# Altium schematic sheet OSRC.SchDoc
size 379 x 394 mm
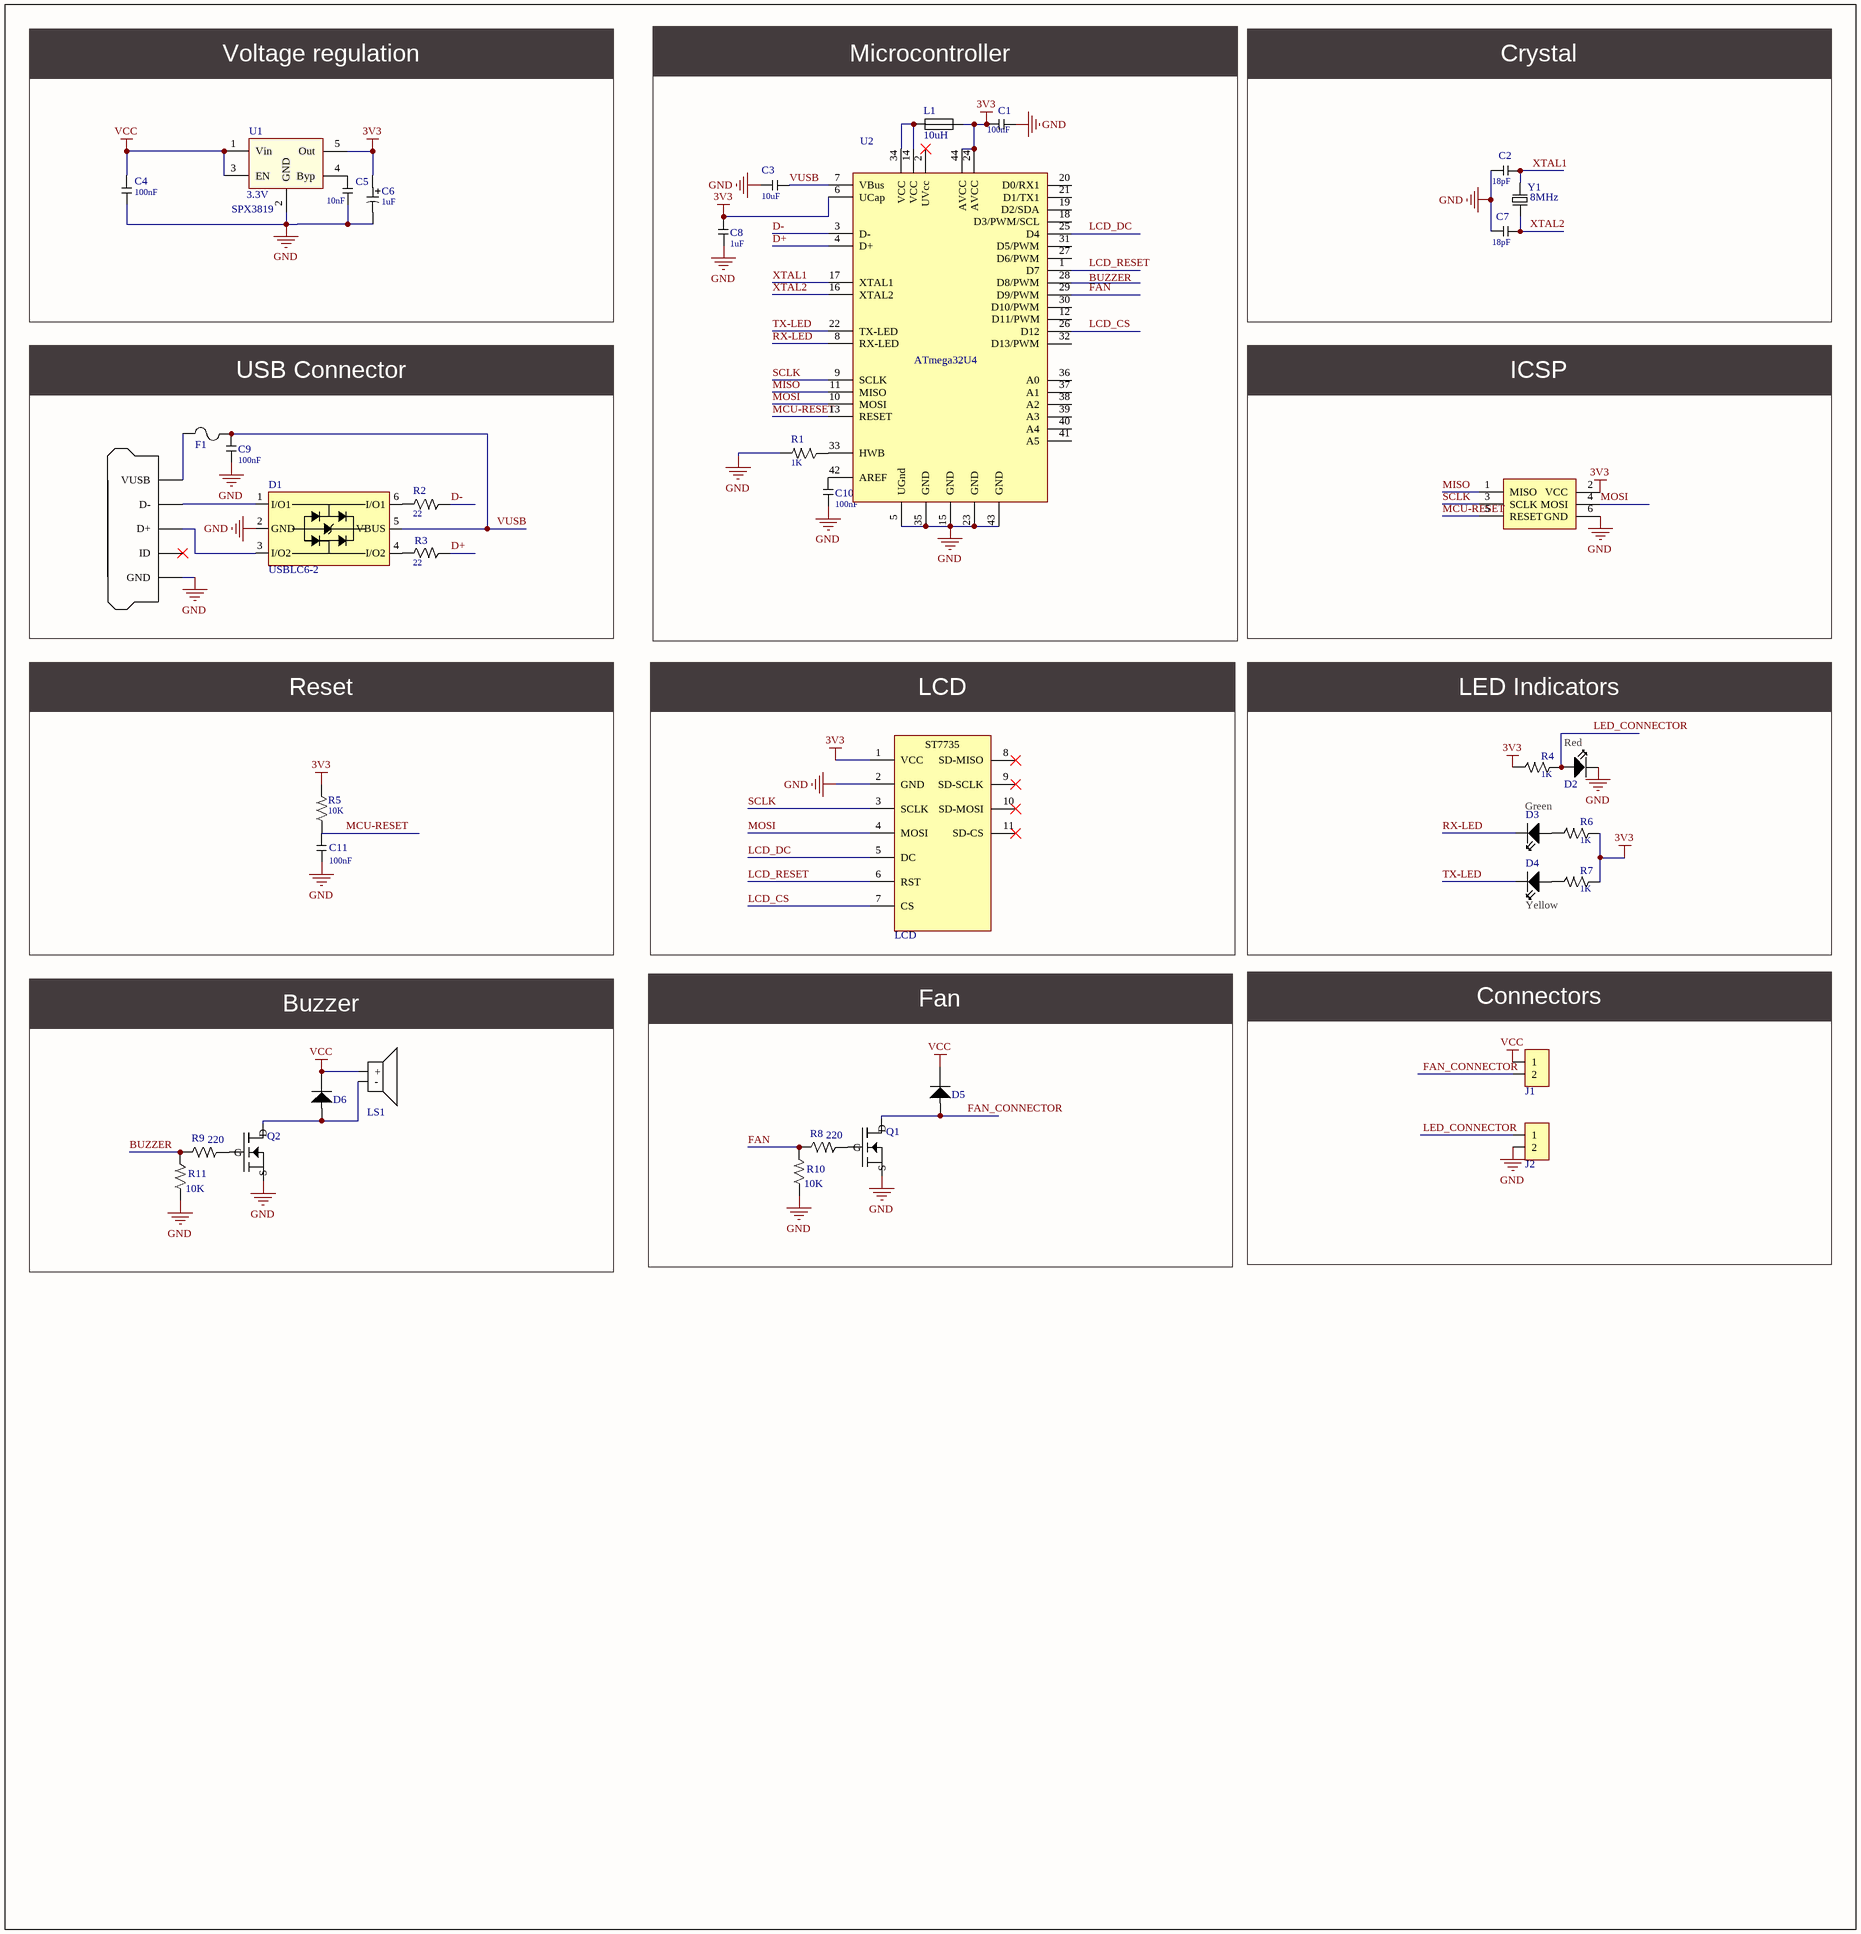
[diagram p0: OSRC.SchDoc]

## Parts
C1  100nF  [CAP-0603-GEN]
C2  18pF  [CAP-0603-GEN]
C3  10uF  [CAP-0603-GEN]
C4  100nF  [CAP-0603-GEN]
C5  10nF  [CAP-0603-GEN]
C6  1uF  [CAP-1206-POL]
C7  18pF  [CAP-0603-GEN]
C8  1uF  [CAP-0603-GEN]
C9  100nF  [CAP-0603-GEN]
C10  100nF  [CAP-0603-GEN]
C11  100nF  [CAP-0603-GEN]
D1  USBLC6-2  [SOT23-6]
D2  Red  [LED 0603 Green]
D3  Green  [LED 0603 Green]
D4  Yellow  [LED 0603 Yellow]
D5  Diode  [DIODE 0603]  (value not drawn)
D6  Diode  [DIODE 0603]  (value not drawn)
F1  Fuse  [FUSE 0603]  (value not drawn)
ICSP1  ICSP  [ICSP-HEADER]  (value not drawn)
J1  Connector 1x2  [PINHEADER 1x2 1.27 Jumper]  (value not drawn)
J2  Connector 1x2  [PINHEADER 1x2 1.27 Jumper]  (value not drawn)
L1  10uH  [FERRITE-0603]
LCD1  LCD  [ST7735]
LS1  Speaker  [Buzzer, Magnetic KTG1212]  (value not drawn)
Q1  (no value)  [SOT23-3]
Q2  (no value)  [SOT23-3]
R1  1K  [RESISTOR 0603]
R2  22  [RESISTOR 0603]
R3  22  [RESISTOR 0603]
R4  1K  [RESISTOR 0603]
R5  10K  [RESISTOR 0603]
R6  1K  [RESISTOR 0603]
R7  1K  [RESISTOR 0603]
R8  220  [RESISTOR 0603]
R9  220  [RESISTOR 0603]
R10  10K  [RESISTOR 0603]
R11  10K  [RESISTOR 0603]
U1  3.3V  [SOT23-5]
U2  ATmega32U4  [TQFP44]
USB1  USB Connector  [USB MICRO-B]  (value not drawn)
Y1  8MHz  [CRYSTAL 5032]

## Blocks framed on the sheet
Voltage regulation: C4-C6 U1
Microcontroller: C1 C3 C8 C10 L1 R1 U2
Crystal: C2 C7 Y1
USB Connector: C9 D1 F1 R2 R3 USB1
ICSP: ICSP1
Reset: C11 R5
LCD: LCD1
LED Indicators: D2-D4 R4 R6 R7
Buzzer: D6 LS1 Q2 R9 R11
Fan: D5 Q1 R8 R10
Connectors: J1 J2

## Nets
3V3: C1.1 C6.1 C8.2 ICSP1.2(VCC) L1.2 LCD1.1(VCC) R4.2 R5.2 R6.1 R7.1 U1.5(Out) U2.6(UCap) U2.24(AVCC) U2.44(AVCC)
GND: C1.2 C2.1 C3.1 C4.1 C5.1 C6.2 C7.1 C8.1 C9.1 C10.2 C11.1 D1.2(GND) D2.2(Cathode) ICSP1.6(GND) J2.2 LCD1.2(GND) Q1.2(S) Q2.2(S) R1.2 R10.1 R11.1 U1.2(GND) U2.5(UGnd) U2.15(GND) U2.23(GND) U2.35(GND) U2.43(GND) USB1.5(GND)
VCC: C4.2 D5.2(Cathode) D6.2(Cathode) J1.1 LS1.1(+) U1.1(Vin) U1.3(EN)
BUZZER: R9.1 R11.2
D+: R3.2 U2.4(D+)
D-: R2.2 U2.3(D-)
FAN: R8.1 R10.2 U2.29(D9/PWM)
FAN_CONNECTOR: D5.1(Anode) J1.2 Q1.3(D)
LCD_CS: LCD1.7(CS) U2.26(D12)
LCD_DC: LCD1.5(DC) U2.25(D4)
LCD_RESET: LCD1.6(RST) U2.1(D7)
LED_CONNECTOR: D2.1(Anode) J2.1 R4.1
MCU-RESET: C11.2 ICSP1.5(RESET) R5.1 U2.13(RESET)
MISO: ICSP1.1(MISO) U2.11(MISO)
MOSI: ICSP1.4(MOSI) LCD1.4(MOSI) U2.10(MOSI)
RX-LED: D3.2(Cathode) U2.8(RX-LED)
SCLK: ICSP1.3(SCLK) LCD1.3(SCLK) U2.9(SCLK)
TX-LED: D4.2(Cathode) U2.22(TX-LED)
VUSB: C3.2 C9.2 D1.5(VBUS) F1.2 U2.7(VBus)
XTAL1: C2.2 U2.17(XTAL1) Y1.2
XTAL2: C7.2 U2.16(XTAL2) Y1.1
NetC5_2: C5.2 U1.4(Byp)
NetC10_1: C10.1 U2.42(AREF)
NetD1_1: D1.1(I/O1) USB1.2(D-)
NetD1_3: D1.3(I/O2) USB1.3(D+)
NetD1_4: D1.4(I/O2) R3.1
NetD1_6: D1.6(I/O1) R2.1
NetD3_1: D3.1(Anode) R6.2
NetD4_1: D4.1(Anode) R7.2
NetD6_1: D6.1(Anode) LS1.2(-) Q2.3(D)
NetF1_1: F1.1 USB1.1(VUSB)
NetL1_1: L1.1 U2.14(VCC) U2.34(VCC)
NetQ1_1: Q1.1(G) R8.2
NetQ2_1: Q2.1(G) R9.2
NetR1_1: R1.1 U2.33(HWB)

Not connected (* = marked no-connect by the designer): LCD1 8(SD-MISO)* 9(SD-SCLK)* 10(SD-MOSI)* 11(SD-CS)*; U2 2(UVcc)* 12(D11/PWM) 18(D3/PWM/SCL) 19(D2/SDA) 20(D0/RX1) 21(D1/TX1) 27(D6/PWM) 28(D8/PWM) 30(D10/PWM) 31(D5/PWM) 32(D13/PWM) 36(A0) 37(A1) 38(A2) 39(A3) 40(A4) 41(A5); USB1 4(ID)*

## Notes on the sheet
- Labels drawn without touching a wire or pin: BUZZER

## Library data of the parts
C1-C5 C7-C11 = Capacitor
  C1 C4 C9-C11: Value: 100nF
  C2 C7: Value: 18pF
  C3: Value: 10uF
  C5: Value: 10nF
  C8: Value: 1uF
C6 = Capacitor polarized: Polarized capacitor; Value: 1uF
D2-D4 = LED
  D2: Color: Red
  D3: Color: Green
  D4: Color: Yellow
ICSP1 = ICSP: In-circuit serial programmer interface
J1 J2 = Connector 1x2: Single row two pin header
L1 = Ferrite bead: Value: 10uH
LCD1 = ST7735: ST7735 color LCD
LS1 = Speaker: Speaker, buzzer
Q1 Q2 = Mosfet N-Channel
R1-R11 = Resistor
  R1 R4 R6 R7: Value: 1K
  R2 R3: Value: 22
  R5 R10 R11: Value: 10K
  R8 R9: Value: 220
U1 = SPX3819: Datasheet: https://www.exar.com/common/content/document.ashx?id=615; Name: SPX3819
U2 = ATmega32U4: 8-bit AVR Microcontroller, 2.7-5.5V, 16MHz, 32KB Flash, 1KB EEPROM, 2.5KB SRAM, USB Controller, 44-pin TQFP, Industrial Grade (-40°C to 85°C), Ext Osc; DatasheetVersion: revF, Nov-2010; PackageVersion: rev.G, Jul-2007; PackageReference: 44ML; PackageDescription: 44-Pin Plastic Thin Quad Flat Pack, 10 x 10 x 1.0 mm Body, 0.8 mm Pitch (TQFP); ComponentLink1Description: Manufacturer URL; ComponentLink1URL: http://www.atmel.com/; ComponentLink2Description: ATmega16U4/32U4 Datasheet; ComponentLink2URL: http://www.atmel.com/dyn/resources/prod_documents/doc7766.pdf; ComponentLink3Description: ATmega16U4 ATmega32U4 Summary; ComponentLink3URL: http://www.atmel.com/dyn/resources/prod_documents/7766S.pdf
Y1 = Crystal: Value: 8MHz
D1 = USBLC6-2: Datasheet: http://www.farnell.com/datasheets/1690354.pdf